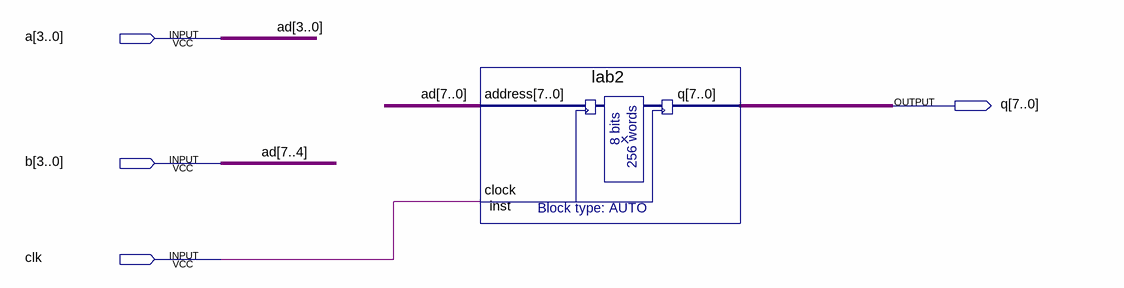
[diagram p0: schematic sheet]
// Quartus schematic block2.bdf as structural Verilog: 1 symbols, 4 pins
module block2 (
  input  [3:0] a,
  input  [3:0] b,
  input  clk,
  output [7:0] q
);

  lab2 inst (.address({b, a}), .clock(clk), .q(q));

  // Other names for the same wires on the sheet: ad[7:0] = {b, a}
endmodule
